# Altium project DDS.PrjPcb
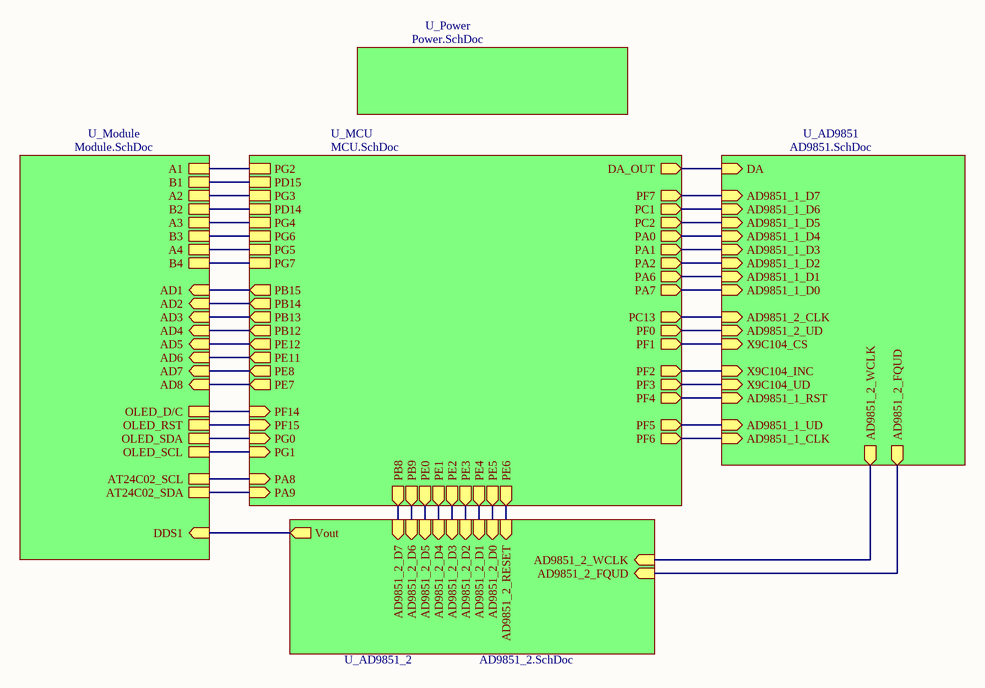
[diagram p0: Top.SchDoc]
5 sheets, 158 parts. Net scope: hierarchical (ports join the sheet entries above them; power ports are global).
Board file: Board.PcbDoc
Sheets:
  Top.SchDoc
    U_MCU = MCU.SchDoc
    U_AD9851 = AD9851.SchDoc
    U_AD9851_2 = AD9851_2.SchDoc
    U_Module = Module.SchDoc

## Sheet Top.SchDoc
size A4

### Sub-sheets
U_AD9851 = AD9851.SchDoc: DA (in), AD9851_1_D7 (in), AD9851_1_D6 (in), AD9851_1_D5 (in), AD9851_1_D3 (in), AD9851_1_D2 (in), AD9851_1_D1 (in), AD9851_1_D0 (in), AD9851_1_D4 (in), AD9851_1_CLK (in), AD9851_1_RST (in), AD9851_1_UD (in), X9C104_INC (in), X9C104_UD (in), X9C104_CS (in), AD9851_2_CLK (in), AD9851_2_UD (in), AD9851_2_WCLK (out), AD9851_2_FQUD (out)
U_AD9851_2 = AD9851_2.SchDoc: AD9851_2_D7 (in), AD9851_2_D6 (in), AD9851_2_D5 (in), AD9851_2_D3 (in), AD9851_2_D2 (in), AD9851_2_D1 (in), AD9851_2_D0 (in), AD9851_2_D4 (in), AD9851_2_WCLK (in), AD9851_2_FQUD (in), Vout (out), AD9851_2_RESET (in)
U_MCU = MCU.SchDoc: PF0 (out), PF1 (out), PF2 (out), PF3 (out), PF4 (out), PF5 (out), PF6 (out), PF7 (out), PG3, PG4, PG2, PG5, PD15, PD14, PG6, PG7, PE8 (out), PE7 (out), PG1, PG0, PF15, PF14, PE12 (out), PE11 (out), PB9 (out), PE0 (out), PE2 (out), PE3 (out), PE4 (out), PE5 (out), PE6 (out), PC13 (out), PA0 (out), PA1 (out), PA2 (out), DA_OUT (out), PC1 (out), PC2 (out), PE1 (out), PB8 (out), PA6 (out), PA7 (out), PB14 (out), PB13 (out), PB12 (out), PB15 (out), PA8, PA9
U_Module = Module.SchDoc: AT24C02_SCL, AT24C02_SDA, A1, B1, A2, B2, A3, B3, A4, B4, OLED_D/C, OLED_RST, OLED_SDA, OLED_SCL, AD4 (in), AD3 (in), AD8 (in), AD7 (in), AD6 (in), AD2 (in), AD5 (in), AD1 (in), DDS1 (in)
U_Power = Power.SchDoc (file not in this document): no entries

### Nets
A1: sheet U_MCU/PG2, sheet U_Module/A1
A2: sheet U_MCU/PG3, sheet U_Module/A2
A3: sheet U_MCU/PG4, sheet U_Module/A3
A4: sheet U_MCU/PG5, sheet U_Module/A4
B1: sheet U_MCU/PD15, sheet U_Module/B1
B2: sheet U_MCU/PD14, sheet U_Module/B2
B3: sheet U_MCU/PG6, sheet U_Module/B3
B4: sheet U_MCU/PG7, sheet U_Module/B4
FQ_UD2: sheet U_AD9851/AD9851_2_FQUD, sheet U_AD9851_2/AD9851_2_FQUD
W_CLK2: sheet U_AD9851/AD9851_2_WCLK, sheet U_AD9851_2/AD9851_2_WCLK
NetJ5_20: sheet U_AD9851_2/Vout, sheet U_Module/DDS1
NetR13_2: sheet U_MCU/PE6, sheet U_AD9851_2/AD9851_2_RESET
NetR24_2: sheet U_MCU/PA8, sheet U_Module/AT24C02_SCL
NetR27_2: sheet U_MCU/PA9, sheet U_Module/AT24C02_SDA
NetR39_2: sheet U_MCU/PB13, sheet U_Module/AD3
NetR40_2: sheet U_MCU/PB12, sheet U_Module/AD4
NetR41_2: sheet U_MCU/PB15, sheet U_Module/AD1
NetR42_2: sheet U_MCU/PB14, sheet U_Module/AD2
NetR47_2: sheet U_MCU/PE12, sheet U_Module/AD5
NetR48_2: sheet U_MCU/PE11, sheet U_Module/AD6
NetR49_2: sheet U_MCU/PE8, sheet U_Module/AD7
NetR50_2: sheet U_MCU/PE7, sheet U_Module/AD8
NetU1_14: sheet U_MCU/PA7, sheet U_AD9851/AD9851_1_D0
NetU1_15: sheet U_MCU/PA6, sheet U_AD9851/AD9851_1_D1
NetU1_16: sheet U_MCU/PA2, sheet U_AD9851/AD9851_1_D2
NetU1_17: sheet U_MCU/PA1, sheet U_AD9851/AD9851_1_D3
NetU1_18: sheet U_MCU/PA0, sheet U_AD9851/AD9851_1_D4
NetU1_19: sheet U_MCU/PC2, sheet U_AD9851/AD9851_1_D5
NetU1_20: sheet U_MCU/PC1, sheet U_AD9851/AD9851_1_D6
NetU1_21: sheet U_MCU/PF7, sheet U_AD9851/AD9851_1_D7
NetU3_14: sheet U_MCU/PF6, sheet U_AD9851/AD9851_1_CLK
NetU3_15: sheet U_MCU/PF5, sheet U_AD9851/AD9851_1_UD
NetU3_16: sheet U_MCU/PF4, sheet U_AD9851/AD9851_1_RST
NetU3_17: sheet U_MCU/PF3, sheet U_AD9851/X9C104_UD
NetU3_18: sheet U_MCU/PF2, sheet U_AD9851/X9C104_INC
NetU3_19: sheet U_MCU/PF1, sheet U_AD9851/X9C104_CS
NetU3_20: sheet U_MCU/PF0, sheet U_AD9851/AD9851_2_UD
NetU3_21: sheet U_MCU/PC13, sheet U_AD9851/AD9851_2_CLK
NetU4_5: sheet U_MCU/DA_OUT, sheet U_AD9851/DA
NetU5_14: sheet U_MCU/PE5, sheet U_AD9851_2/AD9851_2_D0
NetU5_15: sheet U_MCU/PE4, sheet U_AD9851_2/AD9851_2_D1
NetU5_16: sheet U_MCU/PE3, sheet U_AD9851_2/AD9851_2_D2
NetU5_17: sheet U_MCU/PE2, sheet U_AD9851_2/AD9851_2_D3
NetU5_18: sheet U_MCU/PE1, sheet U_AD9851_2/AD9851_2_D4
NetU5_19: sheet U_MCU/PE0, sheet U_AD9851_2/AD9851_2_D5
NetU5_20: sheet U_MCU/PB9, sheet U_AD9851_2/AD9851_2_D6
NetU5_21: sheet U_MCU/PB8, sheet U_AD9851_2/AD9851_2_D7
NetU7_54: sheet U_MCU/PF14, sheet U_Module/OLED_D/C
NetU7_55: sheet U_MCU/PF15, sheet U_Module/OLED_RST
NetU7_56: sheet U_MCU/PG0, sheet U_Module/OLED_SDA
NetU7_57: sheet U_MCU/PG1, sheet U_Module/OLED_SCL

## Sheet MCU.SchDoc
size A4
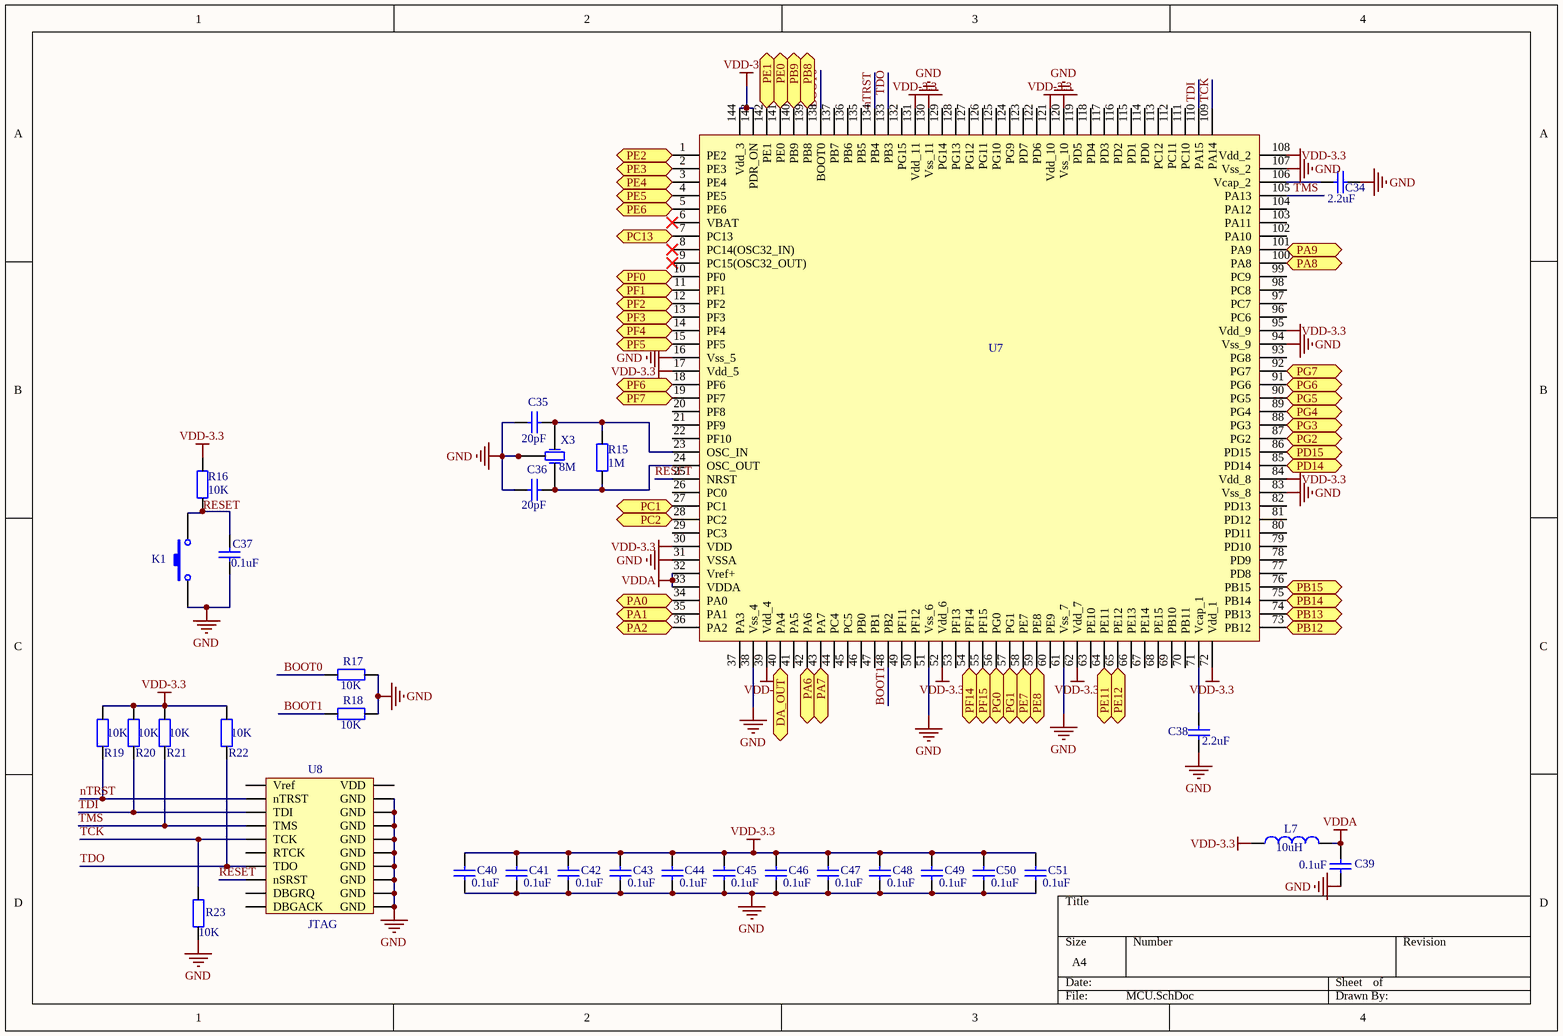
[diagram p1: MCU.SchDoc]

### Parts
C34  value 2.2uF  [0603]  (hidden comment: Capacitor-0603)
C35  value 20pF  [0603]  (hidden comment: Capacitor-0603)
C36  value 20pF  [0603]  (hidden comment: Capacitor-0603)
C37  value 0.1uF  [0603]  (hidden comment: Capacitor-0805)
C38  value 2.2uF  [0603]  (hidden comment: Capacitor-0603)
C39  value 0.1uF  [0603]  (hidden comment: Capacitor-0805)
C40  value 0.1uF  [0603]  (hidden comment: Capacitor-0603)
C41  value 0.1uF  [0603]  (hidden comment: Capacitor-0603)
C42  value 0.1uF  [0603]  (hidden comment: Capacitor-0603)
C43  value 0.1uF  [0603]  (hidden comment: Capacitor-0603)
C44  value 0.1uF  [0603]  (hidden comment: Capacitor-0603)
C45  value 0.1uF  [0603]  (hidden comment: Capacitor-0603)
C46  value 0.1uF  [0603]  (hidden comment: Capacitor-0603)
C47  value 0.1uF  [0603]  (hidden comment: Capacitor-0603)
C48  value 0.1uF  [0603]  (hidden comment: Capacitor-0603)
C49  value 0.1uF  [0603]  (hidden comment: Capacitor-0603)
C50  value 0.1uF  [0603]  (hidden comment: Capacitor-0603)
C51  value 0.1uF  [0603]  (hidden comment: Capacitor-0603)
K1  按键  [贴片按键]  (value not drawn)
L7  value 10uH  [0805]  (hidden comment: Inductor)
R15  value 1M  [0603]  (hidden comment: Resistor-0603)
R16  value 10K  [0603]  (hidden comment: Resistor-0805)
R17  value 10K  [0603]  (hidden comment: Resistor-0805)
R18  value 10K  [0603]  (hidden comment: Resistor-0805)
R19  value 10K  [0603]  (hidden comment: Resistor-0805)
R20  value 10K  [0603]  (hidden comment: Resistor-0805)
R21  value 10K  [0603]  (hidden comment: Resistor-0805)
R22  value 10K  [0603]  (hidden comment: Resistor-0805)
R23  value 10K  [0603]  (hidden comment: Resistor-0805)
U7  value STM32F407ZET6  [Stm32f407ZET6 - duplicate]  (hidden comment: STM32F407ZGT6)
U8  JTAG  [JTAG-20]
X3  value 8M  [3225无源晶振]  (hidden comment: 3225无源晶振)

### Ports
DA_OUT (out), PA0 (out), PA1 (out), PA2 (out), PA6 (out), PA7 (out), PA8, PA9, PB8 (out), PB9 (out), PB12, PB13, PB14, PB15, PC1 (out), PC2 (out), PC13 (out), PD14, PD15, PE0 (out), PE1 (out), PE2 (out), PE3 (out), PE4 (out), PE5 (out), PE6 (out), PE7 (out), PE8 (out), PE11 (out), PE12 (out), PF0 (out), PF1 (out), PF2 (out), PF3 (out), PF4 (out), PF5 (out), PF6 (out), PF7 (out), PF14 (out), PF15 (out), PG0 (out), PG1 (out), PG2, PG3, PG4, PG5, PG6, PG7

### Nets
GND: C34.2 C35.1 C36.1 C37.1 C38.1 C39.1 C40.1 C41.1 C42.1 C43.1 C44.1 C45.1 C46.1 C47.1 C48.1 C49.1 C50.1 C51.1 K1.1 R17.1 R18.1 R23.1 U7.16(Vss_5) U7.31(VSSA) U7.38(Vss_4) U7.51(Vss_6) U7.61(Vss_7) U7.83(Vss_8) U7.94(Vss_9) U7.107(Vss_2) U7.120(Vss_10) U7.130(Vss_11) U8.4(GND) U8.6(GND) U8.8(GND) U8.10(GND) U8.12(GND) U8.14(GND) U8.16(GND) U8.18(GND) U8.20(GND) X3.2(GND) X3.4(GND)
VDD-3.3: C40.2 C41.2 C42.2 C43.2 C44.2 C45.2 C46.2 C47.2 C48.2 C49.2 C50.2 C51.2 L7.1 R16.2 R19.2 R20.2 R21.2 R22.2 U7.17(Vdd_5) U7.30(VDD) U7.39(Vdd_4) U7.52(Vdd_6) U7.62(Vdd_7) U7.72(Vdd_1) U7.84(Vdd_8) U7.95(Vdd_9) U7.108(Vdd_2) U7.121(Vdd_10) U7.131(Vdd_11) U7.143(PDR_ON) U7.144(Vdd_3)
VDDA: C39.2 L7.2 U7.32(Vref+) U7.33(VDDA)
A1: U7.87(PG2) ; port PG2
A2: U7.88(PG3) ; port PG3
A3: U7.89(PG4) ; port PG4
A4: U7.90(PG5) ; port PG5
B1: U7.86(PD15) ; port PD15
B2: U7.85(PD14) ; port PD14
B3: U7.91(PG6) ; port PG6
B4: U7.92(PG7) ; port PG7
BOOT0: R17.2 U7.138(BOOT0)
BOOT1: R18.2 U7.48(PB2)
nTRST: R19.1 U7.134(PB4) U8.3(nTRST)
RESET: C37.2 K1.2 R16.1 U7.25(NRST) U8.15(nSRST)
TCK: R23.2 U7.109(PA14) U8.9(TCK)
TDI: R20.1 U7.110(PA15) U8.5(TDI)
TDO: R22.1 U7.133(PB3) U8.13(TDO)
TMS: R21.1 U7.105(PA13) U8.7(TMS)
NetC34_1: C34.1 U7.106(Vcap_2)
NetC35_2: C35.2 R15.2 U7.23(OSC_IN) X3.1(OSC1)
NetC36_2: C36.2 R15.1 U7.24(OSC_OUT) X3.3(OSC2)
NetC38_2: C38.2 U7.71(Vcap_1)
NetR13_2: U7.5(PE6) ; port PE6
NetR24_2: U7.100(PA8) ; port PA8
NetR27_2: U7.101(PA9) ; port PA9
NetR39_2: U7.74(PB13) ; port PB13
NetR40_2: U7.73(PB12) ; port PB12
NetR41_2: U7.76(PB15) ; port PB15
NetR42_2: U7.75(PB14) ; port PB14
NetR47_2: U7.65(PE12) ; port PE12
NetR48_2: U7.64(PE11) ; port PE11
NetR49_2: U7.59(PE8) ; port PE8
NetR50_2: U7.58(PE7) ; port PE7
NetU1_14: U7.43(PA7) ; port PA7
NetU1_15: U7.42(PA6) ; port PA6
NetU1_16: U7.36(PA2) ; port PA2
NetU1_17: U7.35(PA1) ; port PA1
NetU1_18: U7.34(PA0) ; port PA0
NetU1_19: U7.28(PC2) ; port PC2
NetU1_20: U7.27(PC1) ; port PC1
NetU1_21: U7.19(PF7) ; port PF7
NetU3_14: U7.18(PF6) ; port PF6
NetU3_15: U7.15(PF5) ; port PF5
NetU3_16: U7.14(PF4) ; port PF4
NetU3_17: U7.13(PF3) ; port PF3
NetU3_18: U7.12(PF2) ; port PF2
NetU3_19: U7.11(PF1) ; port PF1
NetU3_20: U7.10(PF0) ; port PF0
NetU3_21: U7.7(PC13) ; port PC13
NetU4_5: U7.40(PA4) ; port DA_OUT
NetU5_14: U7.4(PE5) ; port PE5
NetU5_15: U7.3(PE4) ; port PE4
NetU5_16: U7.2(PE3) ; port PE3
NetU5_17: U7.1(PE2) ; port PE2
NetU5_18: U7.142(PE1) ; port PE1
NetU5_19: U7.141(PE0) ; port PE0
NetU5_20: U7.140(PB9) ; port PB9
NetU5_21: U7.139(PB8) ; port PB8
NetU7_54: U7.54(PF14) ; port PF14
NetU7_55: U7.55(PF15) ; port PF15
NetU7_56: U7.56(PG0) ; port PG0
NetU7_57: U7.57(PG1) ; port PG1

Not connected (* = marked no-connect by the designer): U7 6(VBAT)* 8(PC14(OSC32_IN))* 9(PC15(OSC32_OUT))* 20(PF8) 21(PF9) 22(PF10) 26(PC0) 29(PC3) 37(PA3) 41(PA5) 44(PC4) 45(PC5) 46(PB0) 47(PB1) 49(PF11) 50(PF12) 53(PF13) 60(PE9) 63(PE10) 66(PE13) 67(PE14) 68(PE15) 69(PB10) 70(PB11) 77(PD8) 78(PD9) 79(PD10) 80(PD11) 81(PD12) 82(PD13) 93(PG8) 96(PC6) 97(PC7) 98(PC8) 99(PC9) 102(PA10) 103(PA11) 104(PA12) 111(PC10) 112(PC11) 113(PC12) 114(PD0) 115(PD1) 116(PD2) 117(PD3) 118(PD4) 119(PD5) 122(PD6) 123(PD7) 124(PG9) 125(PG10) 126(PG11) 127(PG12) 128(PG13) 129(PG14) 132(PG15) 135(PB5) 136(PB6) 137(PB7); U8 1(Vref) 2(VDD) 11(RTCK) 17(DBGRQ) 19(DBGACK)

### Library data of the parts
C37 = Capacitor-0
C39 = Capacitor
L7 = Ind
R16-R23 = Resistor-0
U7 = STM32F407ZET6
U8 = J: Value: JTAG

## Sheet AD9851.SchDoc
size A4
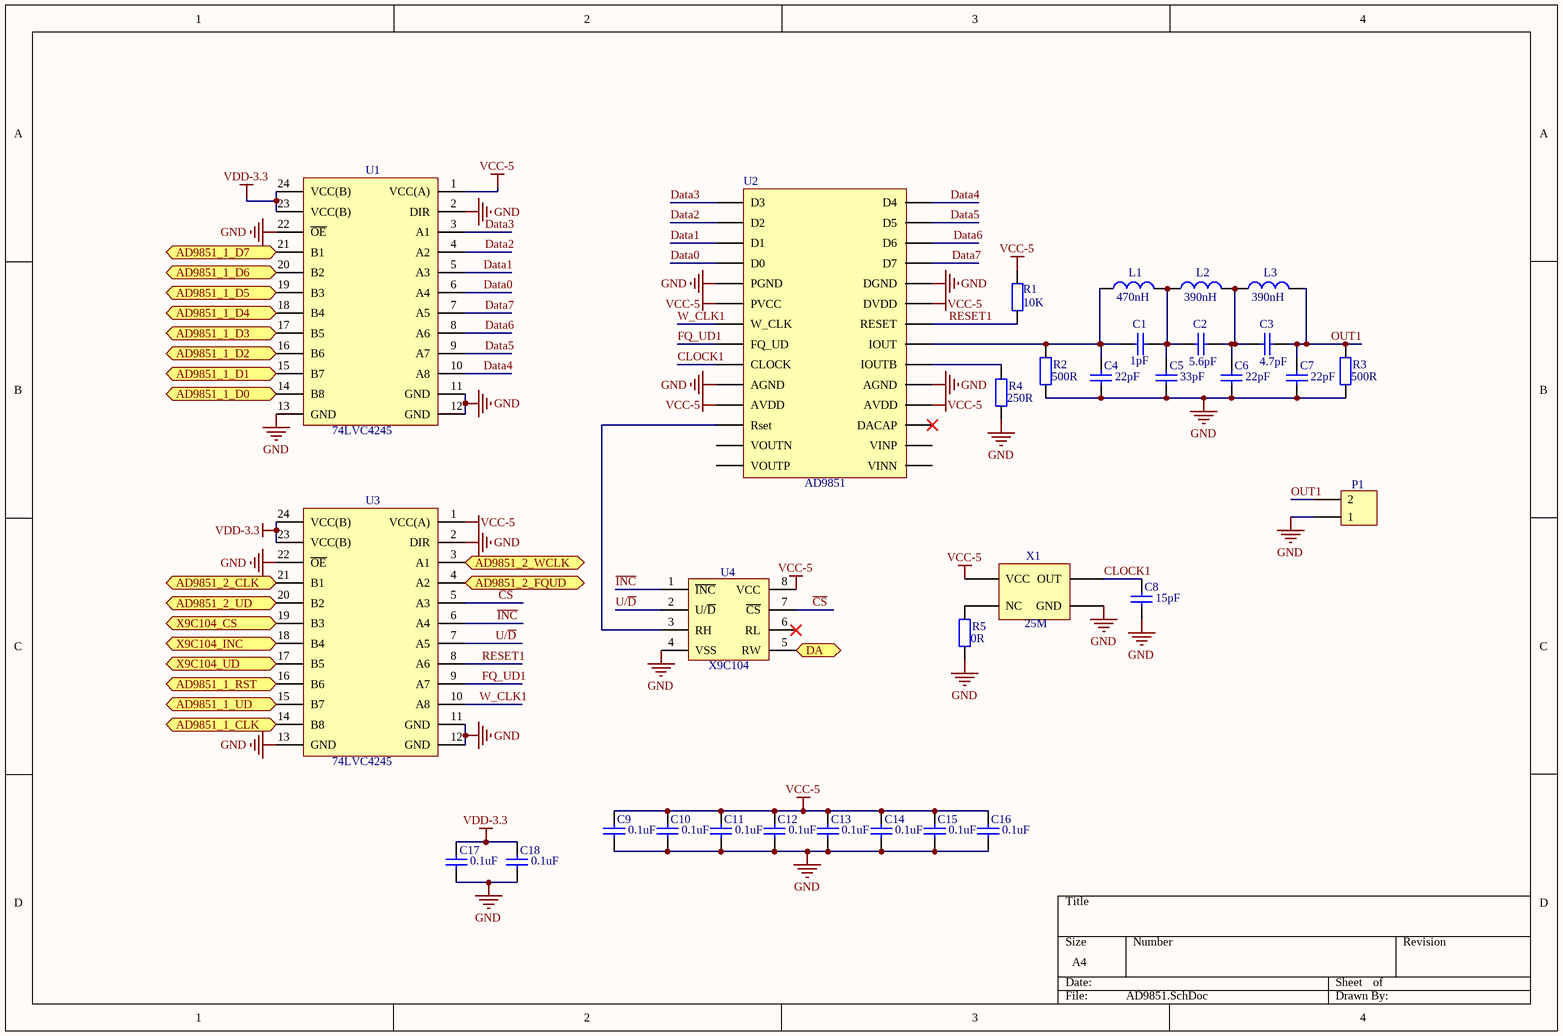
[diagram p2: AD9851.SchDoc]

### Parts
C1  value 1pF  [0603]  (hidden comment: Capacitor-0603)
C2  value 5.6pF  [0603]  (hidden comment: Capacitor-0603)
C3  value 4.7pF  [0603]  (hidden comment: Capacitor-0603)
C4  value 22pF  [0603]  (hidden comment: Capacitor-0603)
C5  value 33pF  [0603]  (hidden comment: Capacitor-0603)
C6  value 22pF  [0603]  (hidden comment: Capacitor-0603)
C7  value 22pF  [0603]  (hidden comment: Capacitor-0603)
C8  value 15pF  [0603]  (hidden comment: Capacitor-0603)
C9  value 0.1uF  [0603]  (hidden comment: Capacitor-0603)
C10  value 0.1uF  [0603]  (hidden comment: Capacitor-0603)
C11  value 0.1uF  [0603]  (hidden comment: Capacitor-0603)
C12  value 0.1uF  [0603]  (hidden comment: Capacitor-0603)
C13  value 0.1uF  [0603]  (hidden comment: Capacitor-0603)
C14  value 0.1uF  [0603]  (hidden comment: Capacitor-0603)
C15  value 0.1uF  [0603]  (hidden comment: Capacitor-0603)
C16  value 0.1uF  [0603]  (hidden comment: Capacitor-0603)
C17  value 0.1uF  [0603]  (hidden comment: Capacitor-0603)
C18  value 0.1uF  [0603]  (hidden comment: Capacitor-0603)
L1  value 470nH  [0805]  (hidden comment: Inductor)
L2  value 390nH  [0805]  (hidden comment: Inductor)
L3  value 390nH  [0805]  (hidden comment: Inductor)
P1  端子  [2MM接线端子]  (value not drawn)
R1  value 10K  [0603]  (hidden comment: Resistor-0603)
R2  value 500R  [0603]  (hidden comment: Resistor-0603)
R3  value 500R  [0603]  (hidden comment: Resistor-0603)
R4  value 250R  [0603]  (hidden comment: Resistor-0603)
R5  value 0R  [0603]  (hidden comment: Resistor-0603)
U1  74LVC4245  [74LVC4245-PW]
U2  AD9851  [AD9851]
U3  74LVC4245  [74LVC4245-PW]
U4  X9C104数字电位器  [X9C104]  (value not drawn)
X1  value 25M  [有源晶振7050]  (hidden comment: 有源晶振)

### Ports
AD9851_1_CLK (in), AD9851_1_D0 (in), AD9851_1_D1 (in), AD9851_1_D2 (in), AD9851_1_D3 (in), AD9851_1_D4 (in), AD9851_1_D5 (in), AD9851_1_D6 (in), AD9851_1_D7 (in), AD9851_1_RST (in), AD9851_1_UD (in), AD9851_2_CLK (in), AD9851_2_FQUD (out), AD9851_2_UD (in), AD9851_2_WCLK (out), DA (in), X9C104_CS (in), X9C104_INC (in), X9C104_UD (in)

### Nets
GND: C4.1 C5.1 C6.1 C7.1 C8.1 C9.1 C10.1 C11.1 C12.1 C13.1 C14.1 C15.1 C16.1 C17.1 C18.1 P1.1 R2.1 R3.1 R4.1 R5.1 U1.2(DIR) U1.11(GND) U1.12(GND) U1.13(GND) U1.22(~{OE}) U2.5(PGND) U2.10(AGND) U2.19(AGND) U2.24(DGND) U3.2(DIR) U3.11(GND) U3.12(GND) U3.13(GND) U3.22(~{OE}) U4.4(VSS) X1.2(GND)
VCC-5: C9.2 C10.2 C11.2 C12.2 C13.2 C14.2 C15.2 C16.2 R1.2 U1.1(VCC(A)) U2.6(PVCC) U2.11(AVDD) U2.18(AVDD) U2.23(DVDD) U3.1(VCC(A)) U4.8(VCC) X1.4(VCC)
VDD-3.3: C17.2 C18.2 U1.23(VCC(B)) U1.24(VCC(B)) U3.23(VCC(B)) U3.24(VCC(B))
~{CS}: U3.5(A3) U4.7(~{CS})
CLOCK1: C8.2 U2.9(CLOCK) X1.3(OUT)
Data0: U1.6(A4) U2.4(D0)
Data1: U1.5(A3) U2.3(D1)
Data2: U1.4(A2) U2.2(D2)
Data3: U1.3(A1) U2.1(D3)
Data4: U1.10(A8) U2.28(D4)
Data5: U1.9(A7) U2.27(D5)
Data6: U1.8(A6) U2.26(D6)
Data7: U1.7(A5) U2.25(D7)
FQ_UD1: U2.8(FQ_UD) U3.9(A7)
FQ_UD2: U3.4(A2) ; port AD9851_2_FQUD
~{INC}: U3.6(A4) U4.1(~{INC})
OUT1: C3.1 C7.2 L3.2 P1.2 R3.2
RESET1: R1.1 U2.22(RESET) U3.8(A6)
U/~{D}: U3.7(A5) U4.2(U/~{D})
W_CLK1: U2.7(W_CLK) U3.10(A8)
W_CLK2: U3.3(A1) ; port AD9851_2_WCLK
NetC1_1: C1.1 C2.2 C5.2 L1.2 L2.1
NetC1_2: C1.2 C4.2 L1.1 R2.2 U2.21(IOUT)
NetC2_1: C2.1 C3.2 C6.2 L2.2 L3.1
NetR4_2: R4.2 U2.20(IOUTB)
NetR5_2: R5.2 X1.1(NC)
NetU1_14: U1.14(B8) ; port AD9851_1_D0
NetU1_15: U1.15(B7) ; port AD9851_1_D1
NetU1_16: U1.16(B6) ; port AD9851_1_D2
NetU1_17: U1.17(B5) ; port AD9851_1_D3
NetU1_18: U1.18(B4) ; port AD9851_1_D4
NetU1_19: U1.19(B3) ; port AD9851_1_D5
NetU1_20: U1.20(B2) ; port AD9851_1_D6
NetU1_21: U1.21(B1) ; port AD9851_1_D7
NetU2_12: U2.12(Rset) U4.3(RH)
NetU3_14: U3.14(B8) ; port AD9851_1_CLK
NetU3_15: U3.15(B7) ; port AD9851_1_UD
NetU3_16: U3.16(B6) ; port AD9851_1_RST
NetU3_17: U3.17(B5) ; port X9C104_UD
NetU3_18: U3.18(B4) ; port X9C104_INC
NetU3_19: U3.19(B3) ; port X9C104_CS
NetU3_20: U3.20(B2) ; port AD9851_2_UD
NetU3_21: U3.21(B1) ; port AD9851_2_CLK
NetU4_5: U4.5(RW) ; port DA

Not connected (* = marked no-connect by the designer): U2 13(VOUTN) 14(VOUTP) 15(VINN) 16(VINP) 17(DACAP)*; U4 6(RL)*

### Library data of the parts
U1 U3 = 74LVC4245: Name: 74LVC4245
U2 = AD9851: Name: AD9851
U4 = X9C104数字电位器: Name: X9C104

## Sheet AD9851_2.SchDoc
size A4
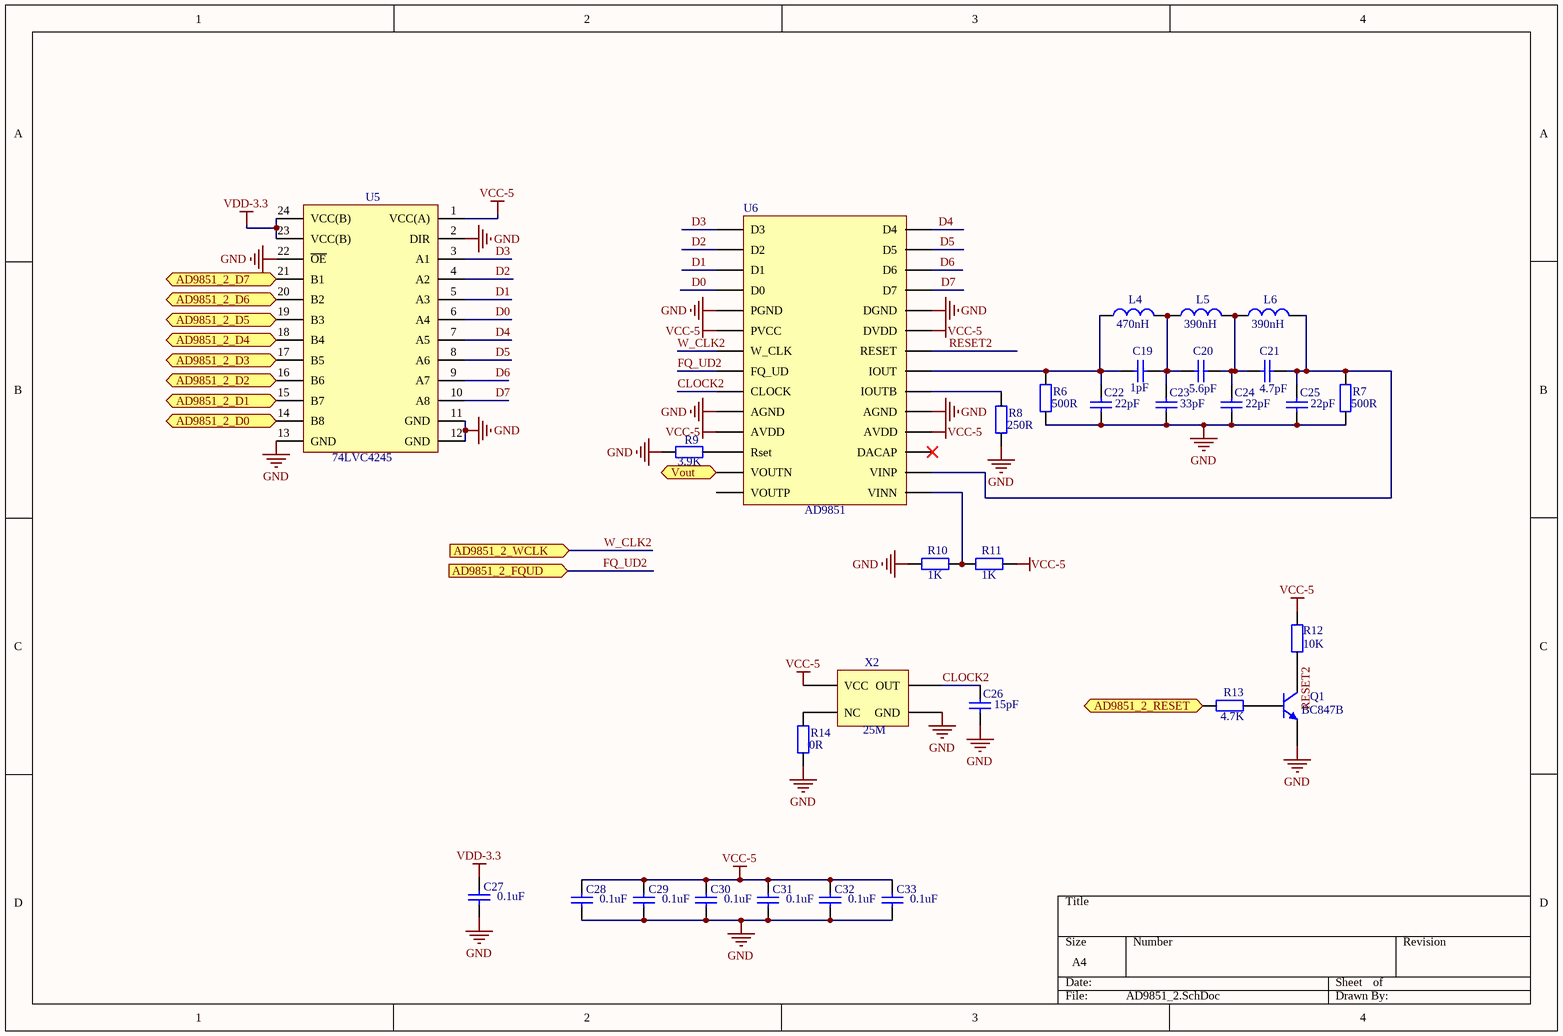
[diagram p3: AD9851_2.SchDoc]

### Parts
C19  value 1pF  [0603]  (hidden comment: Capacitor-0603)
C20  value 5.6pF  [0603]  (hidden comment: Capacitor-0603)
C21  value 4.7pF  [0603]  (hidden comment: Capacitor-0603)
C22  value 22pF  [0603]  (hidden comment: Capacitor-0603)
C23  value 33pF  [0603]  (hidden comment: Capacitor-0603)
C24  value 22pF  [0603]  (hidden comment: Capacitor-0603)
C25  value 22pF  [0603]  (hidden comment: Capacitor-0603)
C26  value 15pF  [0603]  (hidden comment: Capacitor-0603)
C27  value 0.1uF  [0603]  (hidden comment: Capacitor-0603)
C28  value 0.1uF  [0603]  (hidden comment: Capacitor-0603)
C29  value 0.1uF  [0603]  (hidden comment: Capacitor-0603)
C30  value 0.1uF  [0603]  (hidden comment: Capacitor-0603)
C31  value 0.1uF  [0603]  (hidden comment: Capacitor-0603)
C32  value 0.1uF  [0603]  (hidden comment: Capacitor-0603)
C33  value 0.1uF  [0603]  (hidden comment: Capacitor-0603)
L4  value 470nH  [0805]  (hidden comment: Inductor)
L5  value 390nH  [0805]  (hidden comment: Inductor)
L6  value 390nH  [0805]  (hidden comment: Inductor)
Q1  BC847  [BC847B]  (value not drawn)
R6  value 500R  [0603]  (hidden comment: Resistor-0603)
R7  value 500R  [0603]  (hidden comment: Resistor-0603)
R8  value 250R  [0603]  (hidden comment: Resistor-0603)
R9  value 3.9K  [0603]  (hidden comment: Resistor-0603)
R10  value 1K  [0603]  (hidden comment: Resistor-0603)
R11  value 1K  [0603]  (hidden comment: Resistor-0603)
R12  value 10K  [0603]  (hidden comment: Resistor-0603)
R13  value 4.7K  [0603]  (hidden comment: Resistor-0603)
R14  value 0R  [0603]  (hidden comment: Resistor-0603)
U5  74LVC4245  [74LVC4245-PW]
U6  AD9851  [AD9851]
X2  value 25M  [有源晶振7050]  (hidden comment: 有源晶振)

### Ports
AD9851_2_D0 (in), AD9851_2_D1 (in), AD9851_2_D2 (in), AD9851_2_D3 (in), AD9851_2_D4 (in), AD9851_2_D5 (in), AD9851_2_D6 (in), AD9851_2_D7 (in), AD9851_2_FQUD (in), AD9851_2_RESET (in), AD9851_2_WCLK (in), Vout (out)

### Nets
GND: C22.1 C23.1 C24.1 C25.1 C26.1 C27.2 C28.2 C29.2 C30.2 C31.2 C32.2 C33.2 Q1.1(E) R6.1 R7.1 R8.1 R9.2 R10.2 R14.1 U5.2(DIR) U5.11(GND) U5.12(GND) U5.13(GND) U5.22(~{OE}) U6.5(PGND) U6.10(AGND) U6.19(AGND) U6.24(DGND) X2.2(GND)
VCC-5: C28.1 C29.1 C30.1 C31.1 C32.1 C33.1 R11.1 R12.2 U5.1(VCC(A)) U6.6(PVCC) U6.11(AVDD) U6.18(AVDD) U6.23(DVDD) X2.4(VCC)
VDD-3.3: C27.1 U5.23(VCC(B)) U5.24(VCC(B))
CLOCK2: C26.2 U6.9(CLOCK) X2.3(OUT)
D0: U5.6(A4) U6.4(D0)
D1: U5.5(A3) U6.3(D1)
D2: U5.4(A2) U6.2(D2)
D3: U5.3(A1) U6.1(D3)
D4: U5.7(A5) U6.28(D4)
D5: U5.8(A6) U6.27(D5)
D6: U5.9(A7) U6.26(D6)
D7: U5.10(A8) U6.25(D7)
FQ_UD2: U6.8(FQ_UD) ; port AD9851_2_FQUD
RESET2: Q1.3(C) R12.1 U6.22(RESET)
W_CLK2: U6.7(W_CLK) ; port AD9851_2_WCLK
NetC19_1: C19.1 C20.2 C23.2 L4.2 L5.1
NetC19_2: C19.2 C22.2 L4.1 R6.2 U6.21(IOUT)
NetC20_1: C20.1 C21.2 C24.2 L5.2 L6.1
NetC21_1: C21.1 C25.2 L6.2 R7.2 U6.16(VINP)
NetJ5_20: U6.13(VOUTN) ; port Vout
NetQ1_2: Q1.2(B) R13.1
NetR8_2: R8.2 U6.20(IOUTB)
NetR9_1: R9.1 U6.12(Rset)
NetR10_1: R10.1 R11.2 U6.15(VINN)
NetR13_2: R13.2 ; port AD9851_2_RESET
NetR14_2: R14.2 X2.1(NC)
NetU5_14: U5.14(B8) ; port AD9851_2_D0
NetU5_15: U5.15(B7) ; port AD9851_2_D1
NetU5_16: U5.16(B6) ; port AD9851_2_D2
NetU5_17: U5.17(B5) ; port AD9851_2_D3
NetU5_18: U5.18(B4) ; port AD9851_2_D4
NetU5_19: U5.19(B3) ; port AD9851_2_D5
NetU5_20: U5.20(B2) ; port AD9851_2_D6
NetU5_21: U5.21(B1) ; port AD9851_2_D7

Not connected (* = marked no-connect by the designer): U6 14(VOUTP) 17(DACAP)*

### Library data of the parts
Q1 = BC847: Name: BC847B
U5 = 74LVC4245: Name: 74LVC4245
U6 = AD9851: Name: AD9851

## Sheet Module.SchDoc
size A4
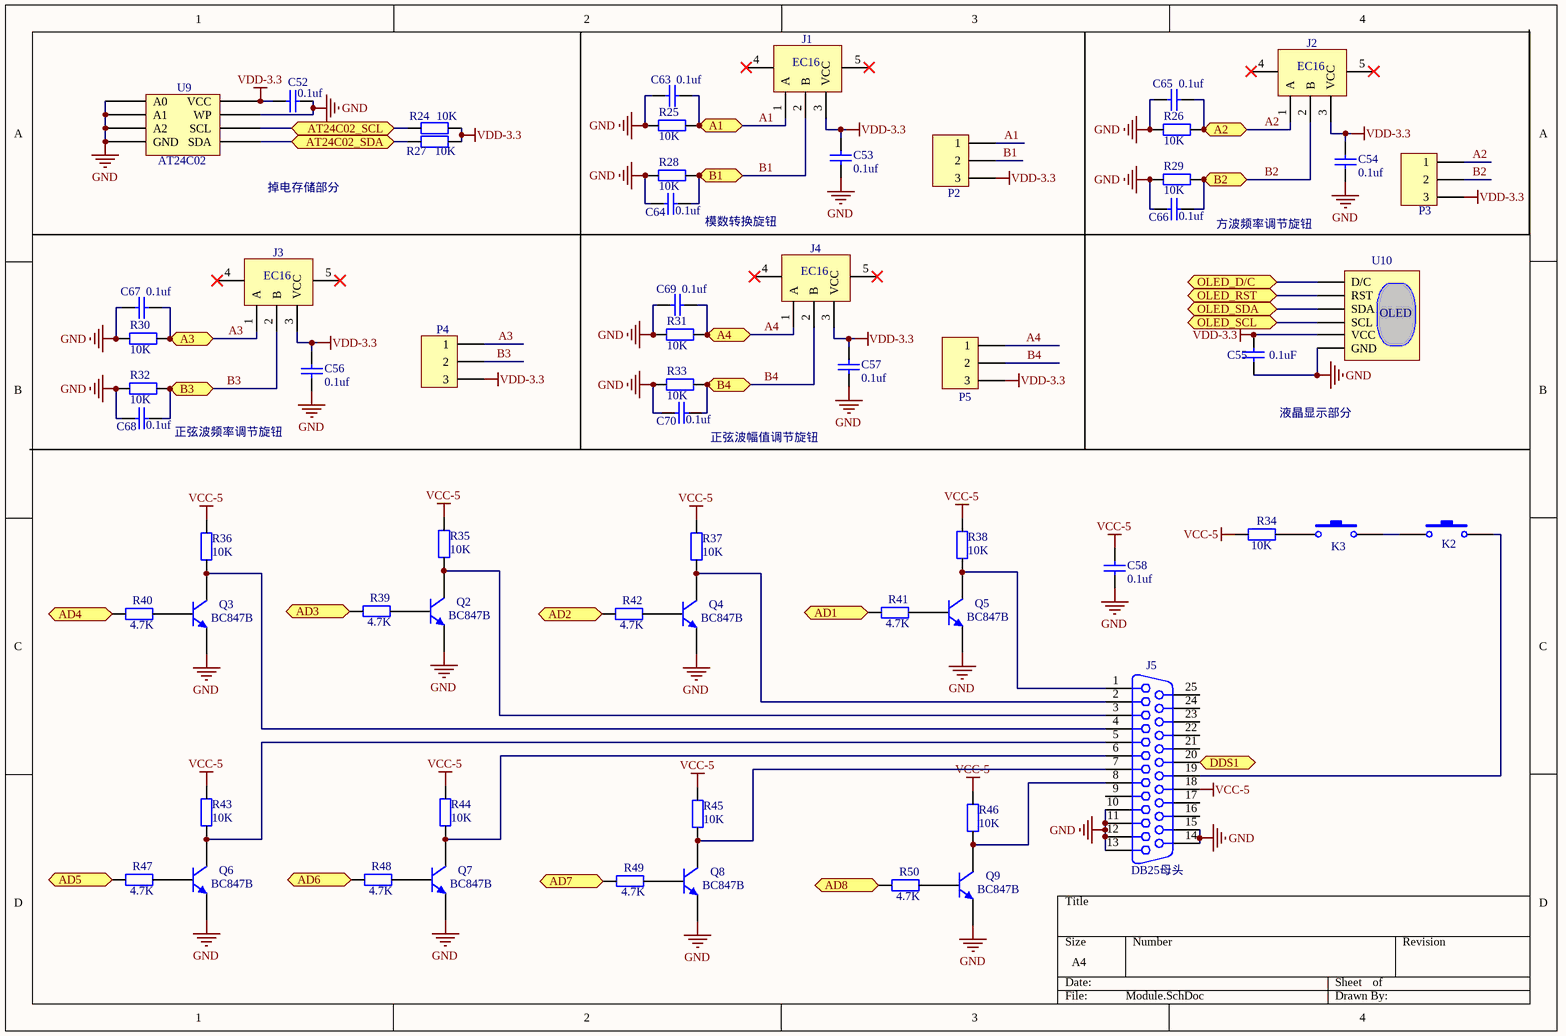
[diagram p4: Module.SchDoc]

### Parts
C52  value 0.1uf  [0603]  (hidden comment: Capacitor-0603)
C53  value 0.1uf  [0603]  (hidden comment: Capacitor-0603)
C54  value 0.1uf  [0603]  (hidden comment: Capacitor-0603)
C55  value 0.1uF  [0603]  (hidden comment: Capacitor-0805)
C56  value 0.1uf  [0603]  (hidden comment: Capacitor-0603)
C57  value 0.1uf  [0603]  (hidden comment: Capacitor-0603)
C58  value 0.1uf  [0603]  (hidden comment: Capacitor-0603)
C63  value 0.1uf  [0603]  (hidden comment: Capacitor-0603)
C64  value 0.1uf  [0603]  (hidden comment: Capacitor-0603)
C65  value 0.1uf  [0603]  (hidden comment: Capacitor-0603)
C66  value 0.1uf  [0603]  (hidden comment: Capacitor-0603)
C67  value 0.1uf  [0603]  (hidden comment: Capacitor-0603)
C68  value 0.1uf  [0603]  (hidden comment: Capacitor-0603)
C69  value 0.1uf  [0603]  (hidden comment: Capacitor-0603)
C70  value 0.1uf  [0603]  (hidden comment: Capacitor-0603)
J1  EC16编码器  [EC16]  (value not drawn)
J2  EC16编码器  [EC16]  (value not drawn)
J3  EC16编码器  [EC16]  (value not drawn)
J4  EC16编码器  [EC16]  (value not drawn)
J5  value DB25母头  [DB25母头]  (hidden comment: DB25)
K2  按键  [2MM接线端子]  (value not drawn)
K3  按键  [2MM接线端子]  (value not drawn)
P2  端子3  [3MM接线端子]  (value not drawn)
P3  端子3  [3MM接线端子]  (value not drawn)
P4  端子3  [3MM接线端子]  (value not drawn)
P5  端子3  [3MM接线端子]  (value not drawn)
Q2  BC847  [BC847B]  (value not drawn)
Q3  BC847  [BC847B]  (value not drawn)
Q4  BC847  [BC847B]  (value not drawn)
Q5  BC847  [BC847B]  (value not drawn)
Q6  BC847  [BC847B]  (value not drawn)
Q7  BC847  [BC847B]  (value not drawn)
Q8  BC847  [BC847B]  (value not drawn)
Q9  BC847  [BC847B]  (value not drawn)
R24  value 10K  [0603]  (hidden comment: Resistor-0603)
R25  value 10K  [0603]  (hidden comment: Resistor-0603)
R26  value 10K  [0603]  (hidden comment: Resistor-0603)
R27  value 10K  [0603]  (hidden comment: Resistor-0603)
R28  value 10K  [0603]  (hidden comment: Resistor-0603)
R29  value 10K  [0603]  (hidden comment: Resistor-0603)
R30  value 10K  [0603]  (hidden comment: Resistor-0603)
R31  value 10K  [0603]  (hidden comment: Resistor-0603)
R32  value 10K  [0603]  (hidden comment: Resistor-0603)
R33  value 10K  [0603]  (hidden comment: Resistor-0603)
R34  value 10K  [0603]  (hidden comment: Resistor-0603)
R35  value 10K  [0603]  (hidden comment: Resistor-0603)
R36  value 10K  [0603]  (hidden comment: Resistor-0603)
R37  value 10K  [0603]  (hidden comment: Resistor-0603)
R38  value 10K  [0603]  (hidden comment: Resistor-0603)
R39  value 4.7K  [0603]  (hidden comment: Resistor-0603)
R40  value 4.7K  [0603]  (hidden comment: Resistor-0603)
R41  value 4.7K  [0603]  (hidden comment: Resistor-0603)
R42  value 4.7K  [0603]  (hidden comment: Resistor-0603)
R43  value 10K  [0603]  (hidden comment: Resistor-0603)
R44  value 10K  [0603]  (hidden comment: Resistor-0603)
R45  value 10K  [0603]  (hidden comment: Resistor-0603)
R46  value 10K  [0603]  (hidden comment: Resistor-0603)
R47  value 4.7K  [0603]  (hidden comment: Resistor-0603)
R48  value 4.7K  [0603]  (hidden comment: Resistor-0603)
R49  value 4.7K  [0603]  (hidden comment: Resistor-0603)
R50  value 4.7K  [0603]  (hidden comment: Resistor-0603)
U9  AT24C02  [AT24C02]
U10  OLED  [OLED]

### Ports
A1, A2, A3, A4, AD1 (in), AD2 (in), AD3 (in), AD4 (in), AD5 (in), AD6 (in), AD7 (in), AD8 (in), AT24C02_SCL, AT24C02_SDA, B1, B2, B3, B4, DDS1 (in), OLED_D/C, OLED_RST, OLED_SCL, OLED_SDA

### Nets
GND: C52.1 C53.2 C54.2 C55.1 C56.2 C57.2 C58.2 C63.1 C64.1 C65.1 C66.1 C67.1 C68.1 C69.1 C70.1 J5.10 J5.11 J5.12 J5.13 J5.14 J5.15 Q2.1(E) Q3.1(E) Q4.1(E) Q5.1(E) Q6.1(E) Q7.1(E) Q8.1(E) Q9.1(E) R25.1 R26.1 R28.1 R29.1 R30.1 R31.1 R32.1 R33.1 U9.1(A0) U9.2(A1) U9.3(A2) U9.4(GND) U9.7(WP) U10.1(GND)
VCC-5: C58.1 J5.18 R34.1 R35.2 R36.2 R37.2 R38.2 R43.2 R44.2 R45.2 R46.2
VDD-3.3: C52.2 C53.1 C54.1 C55.2 C56.1 C57.1 J1.3(VCC) J2.3(VCC) J3.3(VCC) J4.3(VCC) P2.3 P3.3 P4.3 P5.3 R24.1 R27.1 U9.8(VCC) U10.2(VCC)
A1: C63.2 J1.1(A) P2.1 R25.2 ; port A1
A2: C65.2 J2.1(A) P3.1 R26.2 ; port A2
A3: C67.2 J3.1(A) P4.1 R30.2 ; port A3
A4: C69.2 J4.1(A) P5.1 R31.2 ; port A4
B1: C64.2 J1.2(B) P2.2 R28.2 ; port B1
B2: C66.2 J2.2(B) P3.2 R29.2 ; port B2
B3: C68.2 J3.2(B) P4.2 R32.2 ; port B3
B4: C70.2 J4.2(B) P5.2 R33.2 ; port B4
NetJ5_1: J5.1 Q5.3(C) R38.1
NetJ5_2: J5.2 Q4.3(C) R37.1
NetJ5_3: J5.3 Q2.3(C) R35.1
NetJ5_4: J5.4 Q3.3(C) R36.1
NetJ5_5: J5.5 Q6.3(C) R43.1
NetJ5_6: J5.6 Q7.3(C) R44.1
NetJ5_7: J5.7 Q8.3(C) R45.1
NetJ5_8: J5.8 Q9.3(C) R46.1
NetJ5_19: J5.19 K2.2
NetJ5_20: J5.20 ; port DDS1
NetK2_1: K2.1 K3.2
NetK3_1: K3.1 R34.2
NetQ2_2: Q2.2(B) R39.1
NetQ3_2: Q3.2(B) R40.1
NetQ4_2: Q4.2(B) R42.1
NetQ5_2: Q5.2(B) R41.1
NetQ6_2: Q6.2(B) R47.1
NetQ7_2: Q7.2(B) R48.1
NetQ8_2: Q8.2(B) R49.1
NetQ9_2: Q9.2(B) R50.1
NetR24_2: R24.2 U9.6(SCL) ; port AT24C02_SCL
NetR27_2: R27.2 U9.5(SDA) ; port AT24C02_SDA
NetR39_2: R39.2 ; port AD3
NetR40_2: R40.2 ; port AD4
NetR41_2: R41.2 ; port AD1
NetR42_2: R42.2 ; port AD2
NetR47_2: R47.2 ; port AD5
NetR48_2: R48.2 ; port AD6
NetR49_2: R49.2 ; port AD7
NetR50_2: R50.2 ; port AD8
NetU7_54: U10.6(D/C) ; port OLED_D/C
NetU7_55: U10.5(RST) ; port OLED_RST
NetU7_56: U10.4(SDA) ; port OLED_SDA
NetU7_57: U10.3(SCL) ; port OLED_SCL

Not connected (* = marked no-connect by the designer): J1 4* 5*; J2 4* 5*; J3 4* 5*; J4 4* 5*; J5 9 16 17 21 22 23 24 25

### Notes on the sheet
- 掉电存储部分
- 模数转换旋钮
- 方波频率调节旋钮
- 正弦波频率调节旋钮
- (near C70) 正弦波幅值调节旋钮
- 液晶显示部分

### Library data of the parts
C55 = Capacitor-0
U10 = O: Name: OLED
J1-J4 = EC16编码器: Name: EC16
Q2-Q9 = BC847: Name: BC847B
U9 = AT24C02: Name: AT24C02

## Nets that join several sheets
GND: MCU (43 pins), AD9851 (36 pins), AD9851_2 (29 pins), Module (43 pins)
VCC-5: AD9851 (17 pins), AD9851_2 (14 pins), Module (11 pins)
VDD-3.3: MCU (31 pins), AD9851 (6 pins), AD9851_2 (C27.1 U5.23 U5.24), Module (18 pins)
A1: MCU (U7.87), Module (C63.2 J1.1 P2.1 R25.2)
A2: MCU (U7.88), Module (C65.2 J2.1 P3.1 R26.2)
A3: MCU (U7.89), Module (C67.2 J3.1 P4.1 R30.2)
A4: MCU (U7.90), Module (C69.2 J4.1 P5.1 R31.2)
B1: MCU (U7.86), Module (C64.2 J1.2 P2.2 R28.2)
B2: MCU (U7.85), Module (C66.2 J2.2 P3.2 R29.2)
B3: MCU (U7.91), Module (C68.2 J3.2 P4.2 R32.2)
B4: MCU (U7.92), Module (C70.2 J4.2 P5.2 R33.2)
FQ_UD2: AD9851 (U3.4), AD9851_2 (U6.8)
NetJ5_20: AD9851_2 (U6.13), Module (J5.20)
NetR13_2: MCU (U7.5), AD9851_2 (R13.2)
NetR24_2: MCU (U7.100), Module (R24.2 U9.6)
NetR27_2: MCU (U7.101), Module (R27.2 U9.5)
NetR39_2: MCU (U7.74), Module (R39.2)
NetR40_2: MCU (U7.73), Module (R40.2)
NetR41_2: MCU (U7.76), Module (R41.2)
NetR42_2: MCU (U7.75), Module (R42.2)
NetR47_2: MCU (U7.65), Module (R47.2)
NetR48_2: MCU (U7.64), Module (R48.2)
NetR49_2: MCU (U7.59), Module (R49.2)
NetR50_2: MCU (U7.58), Module (R50.2)
NetU1_14: MCU (U7.43), AD9851 (U1.14)
NetU1_15: MCU (U7.42), AD9851 (U1.15)
NetU1_16: MCU (U7.36), AD9851 (U1.16)
NetU1_17: MCU (U7.35), AD9851 (U1.17)
NetU1_18: MCU (U7.34), AD9851 (U1.18)
NetU1_19: MCU (U7.28), AD9851 (U1.19)
NetU1_20: MCU (U7.27), AD9851 (U1.20)
NetU1_21: MCU (U7.19), AD9851 (U1.21)
NetU3_14: MCU (U7.18), AD9851 (U3.14)
NetU3_15: MCU (U7.15), AD9851 (U3.15)
NetU3_16: MCU (U7.14), AD9851 (U3.16)
NetU3_17: MCU (U7.13), AD9851 (U3.17)
NetU3_18: MCU (U7.12), AD9851 (U3.18)
NetU3_19: MCU (U7.11), AD9851 (U3.19)
NetU3_20: MCU (U7.10), AD9851 (U3.20)
NetU3_21: MCU (U7.7), AD9851 (U3.21)
NetU4_5: MCU (U7.40), AD9851 (U4.5)
NetU5_14: MCU (U7.4), AD9851_2 (U5.14)
NetU5_15: MCU (U7.3), AD9851_2 (U5.15)
NetU5_16: MCU (U7.2), AD9851_2 (U5.16)
NetU5_17: MCU (U7.1), AD9851_2 (U5.17)
NetU5_18: MCU (U7.142), AD9851_2 (U5.18)
NetU5_19: MCU (U7.141), AD9851_2 (U5.19)
NetU5_20: MCU (U7.140), AD9851_2 (U5.20)
NetU5_21: MCU (U7.139), AD9851_2 (U5.21)
NetU7_54: MCU (U7.54), Module (U10.6)
NetU7_55: MCU (U7.55), Module (U10.5)
NetU7_56: MCU (U7.56), Module (U10.4)
NetU7_57: MCU (U7.57), Module (U10.3)
W_CLK2: AD9851 (U3.3), AD9851_2 (U6.7)